# EAGLE schematic PSU (EAGLE 9.6.2)

## Sheet 1 of 2
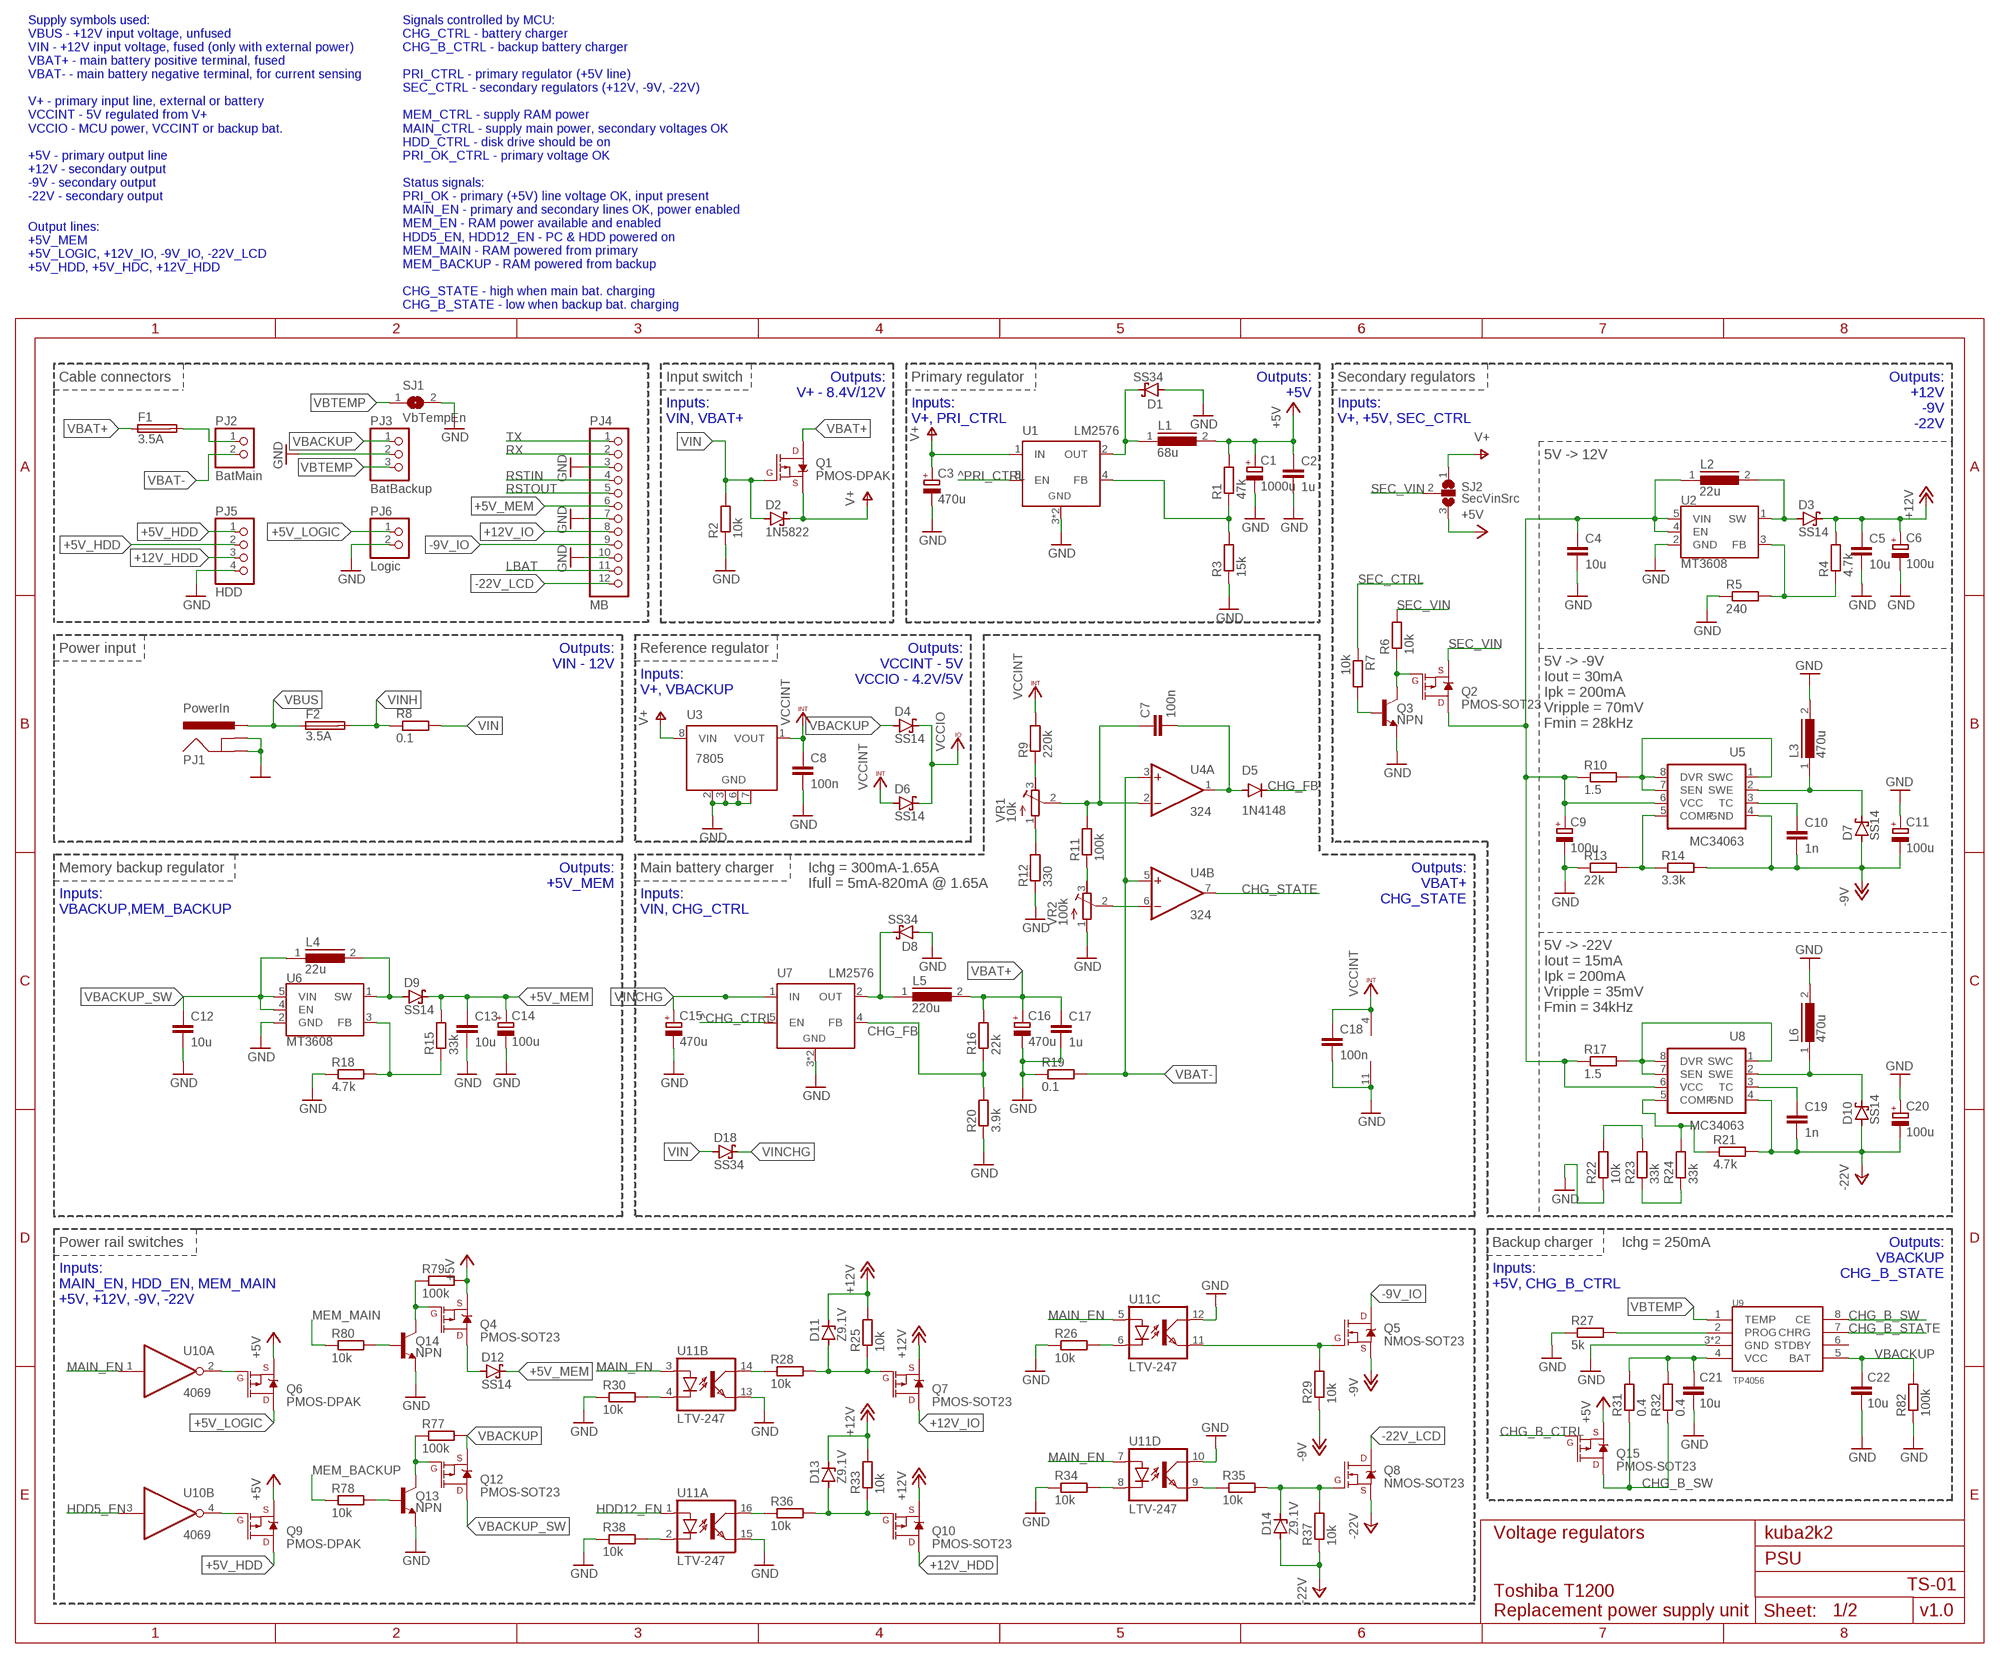
[diagram p0: schematic, sheet 1]

### Parts
C1  1000u  CPOL-EUE5-10.5  [E5-10,5]
C2  1u  C-EU050-024X044  [C050-024X044]
C3  470u  CPOL-EUE3.5-8  [E3,5-8]
C4  10u  C-EUC1206  [C1206]
C5  10u  C-EUC1206  [C1206]
C6  100u  CPOL-EUE3.5-8  [E3,5-8]
C7  100n  C-EUC0805  [C0805]
C8  100n  C-EUC0805  [C0805]
C9  100u  CPOL-EUE3.5-8  [E3,5-8]
C10  1n  C-EUC0805  [C0805]
C11  100u  CPOL-EUE3.5-8  [E3,5-8]
C12  10u  C-EUC1206  [C1206]
C13  10u  C-EUC1206  [C1206]
C14  100u  CPOL-EUE3.5-8  [E3,5-8]
C15  470u  CPOL-EUE3.5-8  [E3,5-8]
C16  470u  CPOL-EUE3.5-8  [E3,5-8]
C17  1u  C-EU050-024X044  [C050-024X044]
C18  100n  C-EUC0805  [C0805]
C19  1n  C-EUC0805  [C0805]
C20  100u  CPOL-EUE3.5-8  [E3,5-8]
C21  10u  C-EUC1206  [C1206]
C22  10u  C-EUC1206  [C1206]
D1  SS34  [SMC]
D2  1N5822  SCHOTTKY-DIODEF126Z12  [F126Z12]
D3  SS14  [DO-214AC]
D4  SS14  [DO-214AC]
D5  1N4148  1N4148DO35-7  [DO35-7]
D6  SS14  [DO-214AC]
D7  SS14  [DO-214AC]
D8  SS34  [SMC]
D9  SS14  [DO-214AC]
D10  SS14  [DO-214AC]
D11  Z9.1V  ZENER-DIODEDO34-7  [DO34Z7]
D12  SS14  [DO-214AC]
D13  Z9.1V  ZENER-DIODEDO34-7  [DO34Z7]
D14  Z9.1V  ZENER-DIODEDO34-7  [DO34Z7]
D18  SS34  [SMC]
F1  3.5A  FUSE-2512  [2512]
F2  3.5A  FUSE-2512  [2512]
L1  68u  SFT1030  [SFT1030]
L2  22u  DR127  [DR127]
L3  470u  COIL0608  [COIL0608]
L4  22u  DR127  [DR127]
L5  220u  SFT1030  [SFT1030]
L6  470u  COIL0608  [COIL0608]
PJ1  PowerIn  POWER_JACK  [POWER_JACK_PTH]
PJ2  BatMain  JST-PH2-4.00  [JST-PH2-4.00]
PJ3  BatBackup  JST-PH3  [JST-PH3]
PJ4  MB  JST-PH12  [JST-PH12]
PJ5  HDD  JST-PH4-2.54  [JST-PH4-2.54]
PJ6  Logic  JST-PH2-2.54  [JST-PH2-2.54]
Q1  PMOS-DPAK  MOSFET_PCH-MCU20P10  [TO-252/DPAK]
Q2  PMOS-SOT23  MOSFET_PCH-IRLML2244  [SOT23-3]
Q3  NPN  TRANS_NPN-MMBT2222AL  [SOT23-3]
Q4  PMOS-SOT23  MOSFET_PCH-IRLML2244  [SOT23-3]
Q5  NMOS-SOT23  MOSFET-NCH-AO3404A  [SOT23-3]
Q6  PMOS-DPAK  MOSFET_PCH-MCU20P10  [TO-252/DPAK]
Q7  PMOS-SOT23  MOSFET_PCH-IRLML2244  [SOT23-3]
Q8  NMOS-SOT23  MOSFET-NCH-AO3404A  [SOT23-3]
Q9  PMOS-DPAK  MOSFET_PCH-MCU20P10  [TO-252/DPAK]
Q10  PMOS-SOT23  MOSFET_PCH-IRLML2244  [SOT23-3]
Q12  PMOS-SOT23  MOSFET_PCH-IRLML2244  [SOT23-3]
Q13  NPN  TRANS_NPN-MMBT2222AL  [SOT23-3]
Q14  NPN  TRANS_NPN-MMBT2222AL  [SOT23-3]
Q15  PMOS-SOT23  MOSFET_PCH-IRLML2244  [SOT23-3]
R1  47k  R-EU_R0805  [R0805]
R2  10k  R-EU_R0805  [R0805]
R3  15k  R-EU_R0805  [R0805]
R4  4.7k  R-EU_R0805  [R0805]
R5  240  R-EU_R0805  [R0805]
R6  10k  R-EU_R0805  [R0805]
R7  10k  R-EU_R0805  [R0805]
R8  0.1  R-EU_0411/15  [0411/15]
R9  220k  R-EU_R0805  [R0805]
R10  1.5  R-EU_0207/10  [0207/10]
R11  100k  R-EU_R0805  [R0805]
R12  330  R-EU_R0805  [R0805]
R13  22k  R-EU_R0805  [R0805]
R14  3.3k  R-EU_R0805  [R0805]
R15  33k  R-EU_R0805  [R0805]
R16  22k  R-EU_R0805  [R0805]
R17  1.5  R-EU_0207/10  [0207/10]
R18  4.7k  R-EU_R0805  [R0805]
R19  0.1  R-EU_0411/15  [0411/15]
R20  3.9k  R-EU_R0805  [R0805]
R21  4.7k  R-EU_R0805  [R0805]
R22  10k  R-EU_R0805  [R0805]
R23  33k  R-EU_R0805  [R0805]
R24  33k  R-EU_R0805  [R0805]
R25  10k  R-EU_R0805  [R0805]
R26  10k  R-EU_R0805  [R0805]
R27  5k  R-EU_R0805  [R0805]
R28  10k  R-EU_R0805  [R0805]
R29  10k  R-EU_R0805  [R0805]
R30  10k  R-EU_R0805  [R0805]
R31  0.4  R-EU_0207/10  [0207/10]
R32  0.4  R-EU_R1206  [R1206]
R33  10k  R-EU_R0805  [R0805]
R34  10k  R-EU_R0805  [R0805]
R35  10k  R-EU_R0805  [R0805]
R36  10k  R-EU_R0805  [R0805]
R37  10k  R-EU_R0805  [R0805]
R38  10k  R-EU_R0805  [R0805]
R77  100k  R-EU_R0805  [R0805]
R78  10k  R-EU_R0805  [R0805]
R79  100k  R-EU_R0805  [R0805]
R80  10k  R-EU_R0805  [R0805]
R82  100k  R-EU_R0805  [R0805]
SJ1  VbTempEn  SJ  [SJ]
SJ2  SecVinSrc  SJ2W  [SJ_2]
U1  LM2576  LM2596TH-VIAHOLE  [TO220-52-VIAHOLE]
U2  MT3608  [SOT23-6]
U3  7805  78L05SMD  [SO08]
U4  324  LM324D  [SO14]
U5  MC34063  MC34063SMD  [SO08]
U6  MT3608  [SOT23-6]
U7  LM2576  LM2596TH-VIAHOLE  [TO220-52-VIAHOLE]
U8  MC34063  MC34063SMD  [SO08]
U9  TP4056  [SO08-PAD]
U10  4069  4069D  [SO14]
U11  LTV-247  [SO16-GULLWING]
VR1  10k  R-TRIMM3296W  [RTRIM3296W]
VR2  100k  R-TRIMM3296W  [RTRIM3296W]

### Nets
+5V [min 1.2A]: C1.+ C2.1 L1.2 Q4.2(S) Q6.3(S) Q9.3(S) Q15.2(S) R1.2 R79.2 SJ2.3 ; also sheet 2
+5V_HDD [2A]: PJ5.1 PJ5.2 Q9.2(D)
+5V_LOGIC [2A]: PJ6.1 Q6.2(D)
+5V_MEM [1.2A]: C13.1 C14.+ D9.C D12.C PJ4.6 R15.2 ; also sheet 2
+5VHDD_G [0.1A]: Q9.1(G) U10.4(B:O)
+5VLOG_G [0.1A]: Q6.1(G) U10.2(A:O)
+5VMEM_B [0.1A]: Q14.1(B) R80.2
+5VMEM_D [1.2A]: D12.A Q4.3(D)
+5VMEM_G [0.1A]: Q4.1(G) Q14.3(C) R79.1
+12V [1.2A]: C5.1 C6.+ D3.C D11.C D13.C Q7.2(S) Q10.2(S) R4.2 R25.2 R33.2 ; also sheet 2
+12V_FB [0.1A]: R4.1 R5.2 U2.3(FB)
+12V_HDD [1.2A]: PJ5.3 Q10.3(D)
+12V_IO [1.2A]: PJ4.8 Q7.3(D)
+12V_SW [1.2A]: D3.A L2.2 U2.1(SW)
+12VHDD_C [0.1A]: R36.1 U11.16(A:COL)
+12VHDD_G [0.1A]: D13.A Q10.1(G) R33.1 R36.2
+12VHDD_N [0.1A]: R38.2 U11.2(A:C)
+12VIO_C [0.1A]: R28.1 U11.14(B:COL)
+12VIO_G [0.1A]: D11.A Q7.1(G) R25.1 R28.2
+12VIO_N [0.1A]: R30.2 U11.4(B:C)
-9V [1.2A]: C10.2 C11.- D7.A Q5.2(S) R14.2 R29.1 U5.4(GND) ; also sheet 2
-9V_COMP [0.1A]: R13.2 R14.1 U5.5(COMP)
-9V_IO [1.2A]: PJ4.9 Q5.3(D)
-9V_SWC [1.2A]: R10.2 U5.1(SWC) U5.7(SEN) U5.8(DVR)
-9V_SWE [1.2A]: D7.C L3.1 U5.2(SWE)
-9V_TC [0.1A]: C10.1 U5.3(TC)
-9VIO_G [0.1A]: Q5.1(G) R29.2 U11.11(C:EMIT)
-9VIO_N [0.1A]: R26.2 U11.6(C:C)
-22V [1.2A]: C19.2 C20.- D10.A D14.A Q8.2(S) R21.2 R37.1 U8.4(GND) ; also sheet 2
-22V_COMP1 [0.1A]: R21.1 R24.2 U8.5(COMP)
-22V_COMP2 [0.1A]: R23.1 R24.1
-22V_COMP3 [0.1A]: R22.2 R23.2
-22V_LCD [1.2A]: PJ4.12 Q8.3(D)
-22V_SWC [1.2A]: R17.2 U8.1(SWC) U8.7(SEN) U8.8(DVR)
-22V_SWE [1.2A]: D10.C L6.1 U8.2(SWE)
-22V_TC [0.1A]: C19.1 U8.3(TC)
-22VLCD_E [0.1A]: R35.1 U11.9(D:EMIT)
-22VLCD_G [0.1A]: D14.C Q8.1(G) R35.2 R37.2
-22VLCD_N [0.1A]: R34.2 U11.8(D:C)
^CHG_CTRL [0.1A]: U7.5(EN) ; also sheet 2
^PRI_CTRL [0.1A]: U1.5(EN) ; also sheet 2
CC_VAL [0.1A]: C7.1 R11.2 U4.2(A:-IN) VR1.2(S)
CHG_B_CTRL [0.1A]: Q15.1(G) ; also sheet 2
CHG_B_PROG [0.1A]: R27.2 U9.2(PROG)
CHG_B_STATE [0.1A]: U9.7(CHRG) ; also sheet 2
CHG_B_SW [min 1.2A]: Q15.3(D) R31.1 R32.1 U9.8(CE)
CHG_B_VCC [1.2A]: C21.1 R31.2 R32.2 U9.4(VCC)
CHG_DIV1 [0.1A]: R11.1 VR2.3(E)
CHG_DIV2 [0.1A]: R12.2 VR1.1(A)
CHG_DIV3 [0.1A]: R9.1 VR1.3(E)
CHG_FB [0.1A]: D5.C R16.1 R20.2 U7.4(FB)
CHG_FB_OUT [0.1A]: C7.2 D5.A U4.1(A:OUT)
CHG_OUT [1.2A]: D8.C L5.1 U7.2(OUT)
CHG_STATE [0.1A]: U4.7(B:OUT) ; also sheet 2
FULL_VAL [0.1A]: U4.6(B:-IN) VR2.2(S)
GND: C1.- C2.2 C3.- C4.2 C5.2 C6.- C8.2 C9.- C11.+ C12.2 C13.2 C14.- C15.- C16.- C17.2 C18.2 C20.+ C21.2 C22.2 D1.A D8.A L3.2 L6.2 PJ1.GND PJ1.GNDBREAK PJ3.2 PJ4.3 PJ4.7 PJ4.10 PJ5.4 PJ6.2 Q3.2(E) Q13.2(E) Q14.2(E) R2.1 R3.1 R5.1 R12.1 R13.1 R18.1 R19.1 R20.1 R22.1 R26.1 R27.1 R30.1 R34.1 R38.1 R82.1 SJ1.2 U1.3(GND) U1.TAB(GND) U2.2(GND) U3.2(GND) U3.3(GND) U3.6(GND) U3.7(GND) U4.11(P:V-) U6.2(GND) U7.3(GND) U7.TAB(GND) U9.3(GND) U9.PAD(GND) U11.10(D:COL) U11.12(C:COL) U11.13(B:EMIT) U11.15(A:EMIT) VR2.1(A) ; also sheet 2
HDD5_EN [0.1A]: U10.3(B:I) ; also sheet 2
HDD12_EN [0.1A]: U11.1(A:A) ; also sheet 2
LBAT [0.1A]: PJ4.11 ; also sheet 2
MAIN_EN [0.1A]: U10.1(A:I) U11.3(B:A) U11.5(C:A) U11.7(D:A) ; also sheet 2
MB_FB [0.1A]: R15.1 R18.2 U6.3(FB)
MB_SW [1.2A]: D9.A L4.2 U6.1(SW)
MEM_BACKUP [0.1A]: R78.1 ; also sheet 2
MEM_MAIN [0.1A]: R80.1 ; also sheet 2
PRI_FB [0.1A]: R1.1 R3.2 U1.4(FB)
PRI_OUT: D1.C L1.1 U1.2(OUT)
RSTIN [0.1A]: PJ4.4 ; also sheet 2
RSTOUT [0.1A]: PJ4.5 ; also sheet 2
RX [0.1A]: PJ4.2 ; also sheet 2
SEC_CTRL [0.1A]: R7.1 ; also sheet 2
SEC_VIN [1.2A]: Q2.2(S) R6.2 SJ2.2
SEC_VIN_SW [1.2A]: C4.1 C9.+ L2.1 Q2.3(D) R10.1 R17.1 U2.4(EN) U2.5(VIN) U5.6(VCC) U8.6(VCC)
SECV_B [0.1A]: Q3.1(B) R7.2
SECV_G [0.1A]: Q2.1(G) Q3.3(C) R6.1
TX [0.1A]: PJ4.1 ; also sheet 2
V+: C3.+ D2.C Q1.3(S) SJ2.1 U1.1(IN) U3.8(VIN) ; also sheet 2
VBACKUP [1.2A]: C22.1 D4.A PJ3.1 Q12.2(S) R77.2 R82.2 U9.5(BAT) ; also sheet 2
VBACKUP_SW [1.2A]: C12.1 L4.1 Q12.3(D) U6.4(EN) U6.5(VIN)
VBACKUP_SW_B [0.1A]: Q13.1(B) R78.2
VBACKUP_SW_G [0.1A]: Q12.1(G) Q13.3(C) R77.1
VBAT+ [min 1.2A]: C16.+ C17.1 F1.1 L5.2 Q1.2(D) R16.2 ; also sheet 2
VBAT- [min 1.2A]: PJ2.2 R19.2 U4.3(A:+IN) U4.5(B:+IN) ; also sheet 2
VBAT_RAW [3A]: F1.2 PJ2.1
VBTEMP [0.1A]: PJ3.3 SJ1.1 U9.1(TEMP)
VBUS [3.5A]: F2.1 PJ1.PWR
VCCINT [0.1A]: C8.1 C18.1 D6.A R9.2 U3.1(VOUT) U4.4(P:V+) ; also sheet 2
VCCIO [0.1A]: D4.C D6.C ; also sheet 2
VIN: D2.A D18.A Q1.1(G) R2.2 R8.2 ; also sheet 2
VINCHG: C15.+ D18.C U7.1(IN)
VINH: F2.2 R8.1 ; also sheet 2
Unconnected: U3.4(NC) U3.5(NC) U9.6(STDBY)

### Notes on the sheet
- Supply symbols used:
  VBUS - +12V input voltage, unfused
  VIN - +12V input voltage, fused (only with external power)
  VBAT+ - main battery positive terminal, fused
  VBAT- - main battery negative terminal, for current sensing
  
  V+ - primary input line, external or battery
  VCCINT - 5V regulated from V+
  VCCIO - MCU power, VCCINT or backup bat.
  
  +5V - primary output line
  +12V - secondary output
  -9V - secondary output
  -22V - secondary output
- Signals controlled by MCU:
  CHG_CTRL - battery charger
  CHG_B_CTRL - backup battery charger
  
  PRI_CTRL - primary regulator (+5V line)
  SEC_CTRL - secondary regulators (+12V, -9V, -22V)
  
  MEM_CTRL - supply RAM power
  MAIN_CTRL - supply main power, secondary voltages OK
  HDD_CTRL - disk drive should be on
  PRI_OK_CTRL - primary voltage OK
  
  Status signals:
  PRI_OK - primary (+5V) line voltage OK, input present
  MAIN_EN - primary and secondary lines OK, power enabled
  MEM_EN - RAM power available and enabled
  HDD5_EN, HDD12_EN - PC & HDD powered on
  MEM_MAIN - RAM powered from primary
  MEM_BACKUP - RAM powered from backup
  
  CHG_STATE - high when main bat. charging
  CHG_B_STATE - low when backup bat. charging
- Output lines:
  +5V_MEM
  +5V_LOGIC, +12V_IO, -9V_IO, -22V_LCD
  +5V_HDD, +5V_HDC, +12V_HDD
- Cable connectors | Input switch
- Outputs:
  V+ - 8.4V/12V
- Primary regulator
- Outputs:
  +5V
- Secondary regulators
- Outputs:
  +12V
  -9V
  -22V
- Inputs:
  VIN, VBAT+
- Inputs:
  V+, PRI_CTRL
- Inputs:
  V+, +5V, SEC_CTRL
- 5V -> 12V
- Power input
- Outputs:
  VIN - 12V
- Reference regulator
- Outputs:
  VCCINT - 5V
  VCCIO - 4.2V/5V
- 5V -> -9V
  Iout = 30mA
  Ipk = 200mA
  Vripple = 70mV
  Fmin = 28kHz
- Inputs:
  V+, VBACKUP
- Memory backup regulator
- Outputs:
  +5V_MEM
- Main battery charger
- Ichg = 300mA-1.65A
  Ifull = 5mA-820mA @ 1.65A
- Outputs:
  VBAT+
  CHG_STATE
- Inputs:
  VBACKUP,MEM_BACKUP
- Inputs:
  VIN, CHG_CTRL
- 5V -> -22V
  Iout = 15mA
  Ipk = 200mA
  Vripple = 35mV
  Fmin = 34kHz
- Power rail switches | Backup charger | Ichg = 250mA
- Outputs:
  VBACKUP
  CHG_B_STATE
- Inputs:
  MAIN_EN, HDD_EN, MEM_MAIN
  +5V, +12V, -9V, -22V
- Inputs:
  +5V, CHG_B_CTRL
- Voltage regulators | kuba2k2
- TS-01
- Toshiba T1200
  Replacement power supply unit
- v1.0

## Sheet 2 of 2
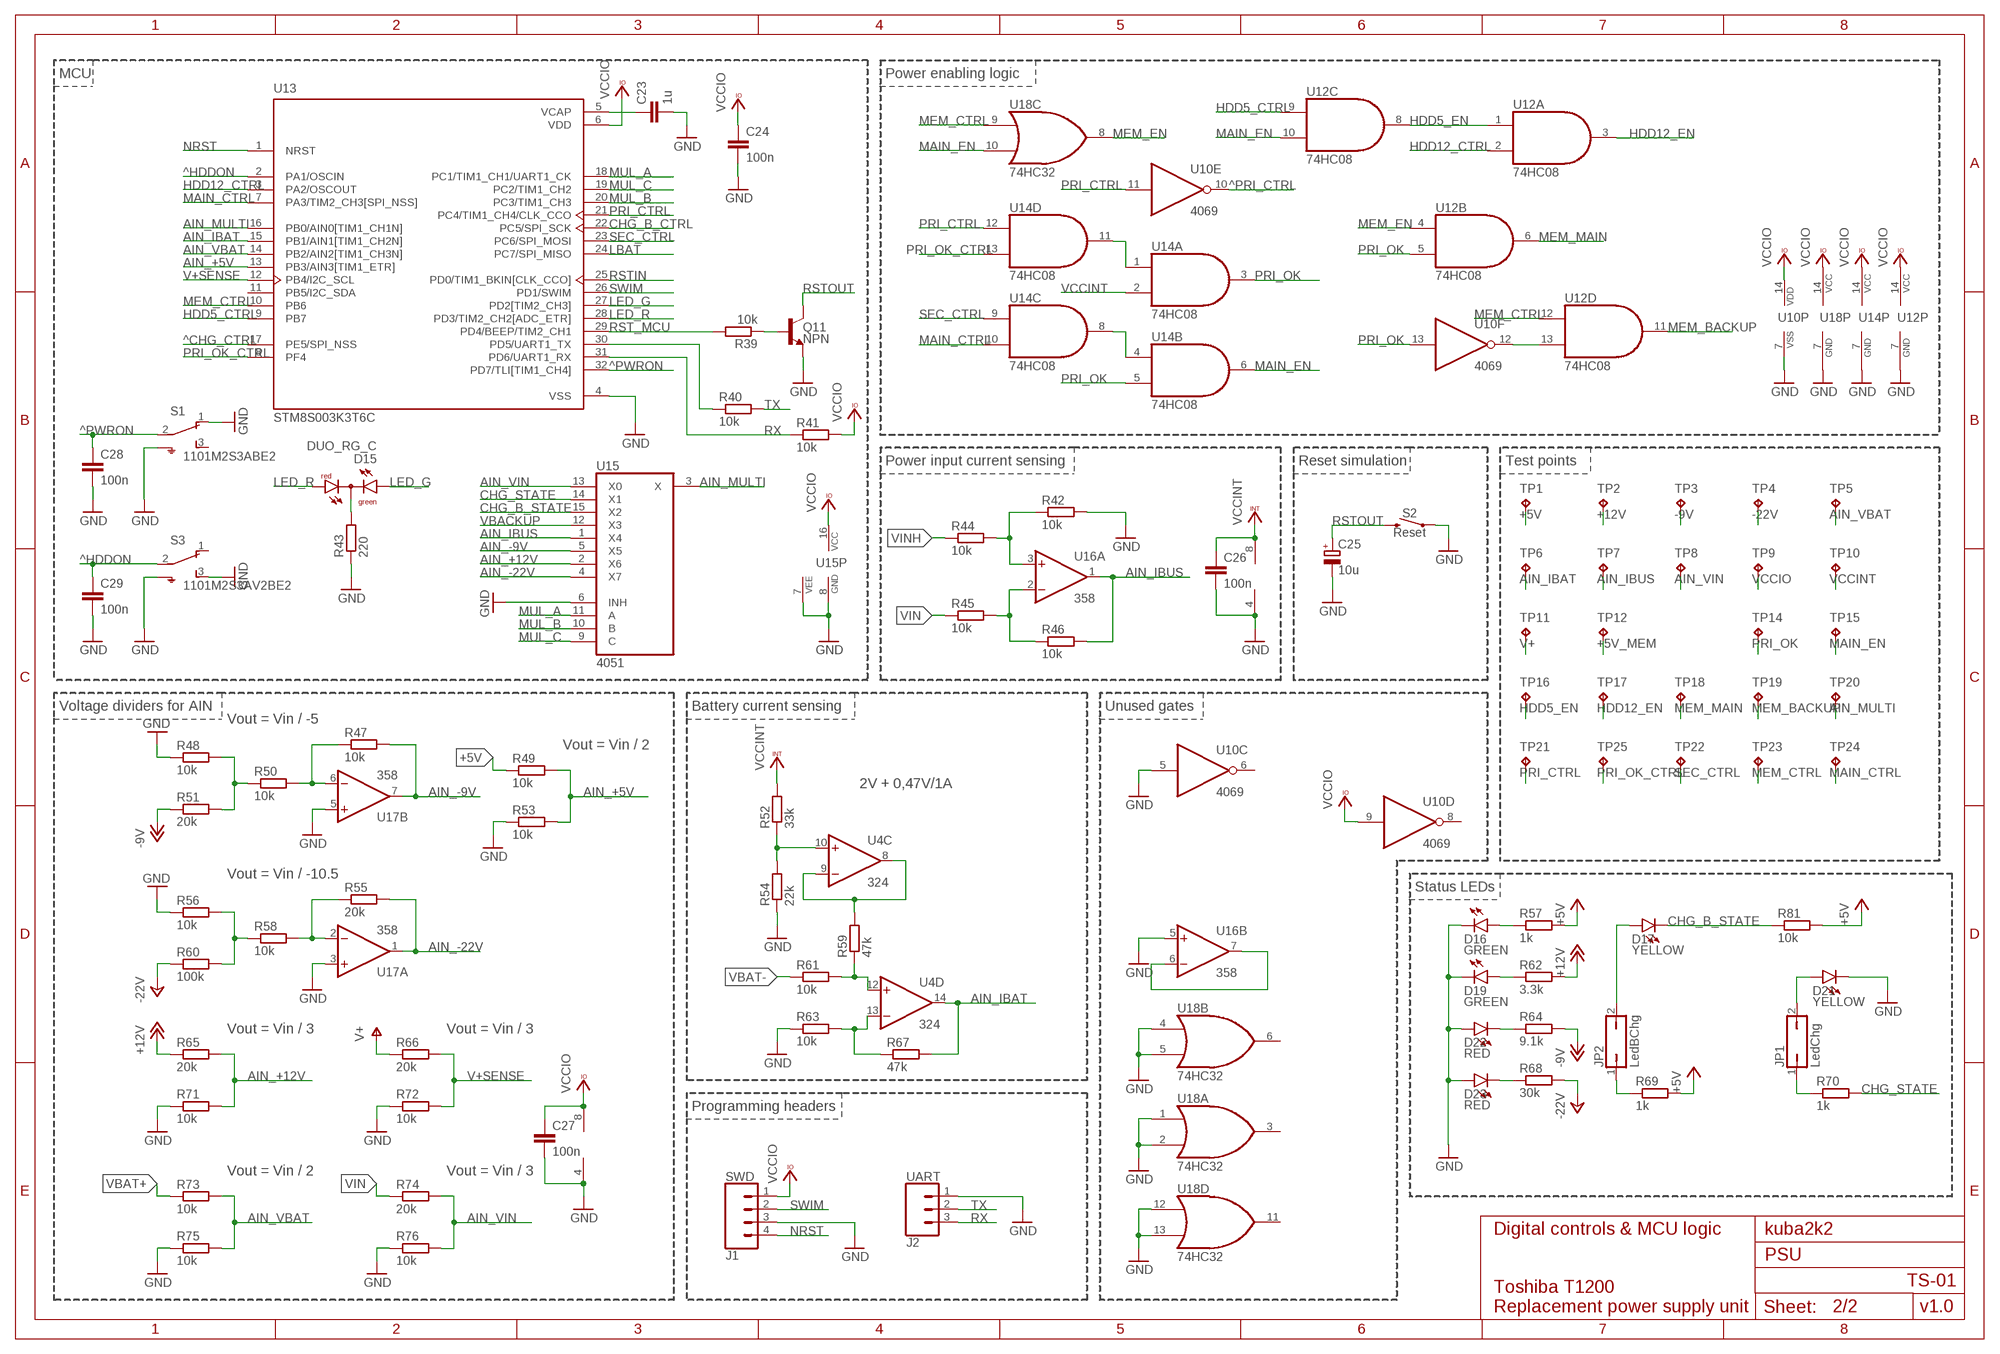
[diagram p1: schematic, sheet 2]

### Parts
C23  1u  C-EU050-024X044  [C050-024X044]
C24  100n  C-EUC0805  [C0805]
C25  10u  CPOL-EUE2-5  [E2-5]
C26  100n  C-EUC0805  [C0805]
C27  100n  C-EUC0805  [C0805]
C28  100n  C-EUC0805  [C0805]
C29  100n  C-EUC0805  [C0805]
D15  DUO_RG_C  DUOLED-RG-C  [DUOLED-C-5MM]
D16  GREEN  LEDCHIP-LED0805  [CHIP-LED0805]
D17  YELLOW  LEDCHIP-LED0805  [CHIP-LED0805]
D19  GREEN  LEDCHIP-LED0805  [CHIP-LED0805]
D21  YELLOW  LEDCHIP-LED0805  [CHIP-LED0805]
D22  RED  LEDCHIP-LED0805  [CHIP-LED0805]
D23  RED  LEDCHIP-LED0805  [CHIP-LED0805]
J1  SWD  CONN_04PTH  [1X04]
J2  UART  CONN_03  [1X03]
JP1  LedChg  JP1Q  [JP1]
JP2  LedBChg  JP1Q  [JP1]
Q11  NPN  TRANS_NPN-MMBT2222AL  [SOT23-3]
R39  10k  R-EU_R0805  [R0805]
R40  10k  R-EU_R0805  [R0805]
R41  10k  R-EU_R0805  [R0805]
R42  10k  R-EU_R0805  [R0805]
R43  220  R-EU_R0805  [R0805]
R44  10k  R-EU_R0805  [R0805]
R45  10k  R-EU_R0805  [R0805]
R46  10k  R-EU_R0805  [R0805]
R47  10k  R-EU_R0805  [R0805]
R48  10k  R-EU_R0805  [R0805]
R49  10k  R-EU_R0805  [R0805]
R50  10k  R-EU_R0805  [R0805]
R51  20k  R-EU_R0805  [R0805]
R52  33k  R-EU_R0805  [R0805]
R53  10k  R-EU_R0805  [R0805]
R54  22k  R-EU_R0805  [R0805]
R55  20k  R-EU_R0805  [R0805]
R56  10k  R-EU_R0805  [R0805]
R57  1k  R-EU_R0805  [R0805]
R58  10k  R-EU_R0805  [R0805]
R59  47k  R-EU_R0805  [R0805]
R60  100k  R-EU_R0805  [R0805]
R61  10k  R-EU_R0805  [R0805]
R62  3.3k  R-EU_R0805  [R0805]
R63  10k  R-EU_R0805  [R0805]
R64  9.1k  R-EU_R0805  [R0805]
R65  20k  R-EU_R0805  [R0805]
R66  20k  R-EU_R0805  [R0805]
R67  47k  R-EU_R0805  [R0805]
R68  30k  R-EU_R0805  [R0805]
R69  1k  R-EU_R0805  [R0805]
R70  1k  R-EU_R0805  [R0805]
R71  10k  R-EU_R0805  [R0805]
R72  10k  R-EU_R0805  [R0805]
R73  10k  R-EU_R0805  [R0805]
R74  20k  R-EU_R0805  [R0805]
R75  10k  R-EU_R0805  [R0805]
R76  10k  R-EU_R0805  [R0805]
R81  10k  R-EU_R0805  [R0805]
S1  1101M2S3ABE2  [1101M2S3ABE2]
S2  Reset  MOMENTARY-SWITCH-SPST-SMD-6.2MM-TALL  [TACTILE_SWITCH_SMD_6.2MM_TALL]
S3  1101M2S3AV2BE2  [1101M2S3AV2BE2]
TP1  TPB1,27  [B1,27]
TP2  TPB1,27  [B1,27]
TP3  TPB1,27  [B1,27]
TP4  TPB1,27  [B1,27]
TP5  TPB1,27  [B1,27]
TP6  TPB1,27  [B1,27]
TP7  TPB1,27  [B1,27]
TP8  TPB1,27  [B1,27]
TP9  TPB1,27  [B1,27]
TP10  TPB1,27  [B1,27]
TP11  TPB1,27  [B1,27]
TP12  TPB1,27  [B1,27]
TP14  TPB1,27  [B1,27]
TP15  TPB1,27  [B1,27]
TP16  TPB1,27  [B1,27]
TP17  TPB1,27  [B1,27]
TP18  TPB1,27  [B1,27]
TP19  TPB1,27  [B1,27]
TP20  TPB1,27  [B1,27]
TP21  TPB1,27  [B1,27]
TP22  TPB1,27  [B1,27]
TP23  TPB1,27  [B1,27]
TP24  TPB1,27  [B1,27]
TP25  TPB1,27  [B1,27]
U12  74HC08  74LS08D  [SO14]
U13  STM8S003K3T6C  [QFP80P900X900X160-32N]
U14  74HC08  74LS08D  [SO14]
U15  4051  4051D  [SO16]
U16  358  LM358D  [SO08]
U17  358  LM358D  [SO08]
U18  74HC32  7432D  [SO14]

### Nets
+5V [min 1.2A]: R49.1 R57.2 R69.2 R81.2 TP1.TP ; also sheet 1
+5V_MEM [1.2A]: TP12.TP ; also sheet 1
+12V [1.2A]: R62.2 R65.1 TP2.TP ; also sheet 1
-9V [1.2A]: R51.1 R64.2 TP3.TP ; also sheet 1
-22V [1.2A]: R60.1 R68.2 TP4.TP ; also sheet 1
^CHG_CTRL [0.1A]: U13.17(PE5/SPI_NSS) ; also sheet 1
^HDDON [0.1A]: C29.1 S3.2(P) U13.2(PA1/OSCIN)
^PRI_CTRL [0.1A]: U10.10(E:O) ; also sheet 1
^PWRON [0.1A]: C28.1 S1.2(P) U13.32(PD7/TLI[TIM1_CH4])
AIN9DIV [0.1A]: R48.2 R50.1 R51.2
AIN9N [0.1A]: R47.1 R50.2 U17.6(B:-IN)
AIN22DIV [0.1A]: R56.2 R58.1 R60.2
AIN22N [0.1A]: R55.1 R58.2 U17.2(A:-IN)
AIN_+5V [0.1A]: R49.2 R53.2 U13.13(PB3/AIN3[TIM1_ETR])
AIN_+12V [0.1A]: R65.2 R71.2 U15.2(X6)
AIN_-9V [0.1A]: R47.2 U15.5(X5) U17.7(B:OUT)
AIN_-22V [0.1A]: R55.2 U15.4(X7) U17.1(A:OUT)
AIN_IBAT [0.1A]: R67.2 TP6.TP U4.14(D:OUT) U13.15(PB1/AIN1[TIM1_CH2N])
AIN_IBUS [0.1A]: R46.2 TP7.TP U15.1(X4) U16.1(A:OUT)
AIN_MULTI [0.1A]: TP20.TP U13.16(PB0/AIN0[TIM1_CH1N]) U15.3(X)
AIN_VBAT [0.1A]: R73.2 R75.2 TP5.TP U13.14(PB2/AIN2[TIM1_CH3N])
AIN_VIN [0.1A]: R74.2 R76.2 TP8.TP U15.13(X0)
CHG_B_CTRL [0.1A]: U13.22(PC5/SPI_SCK) ; also sheet 1
CHG_B_STATE [0.1A]: D17.C R81.1 U15.15(X2) ; also sheet 1
CHG_STATE [0.1A]: R70.2 U15.14(X1) ; also sheet 1
GND: C23.2 C24.2 C25.- C26.2 C27.2 C28.2 C29.2 D16.C D19.C D21.C D22.A D23.A J1.3 J2.1 Q11.2(E) R42.2 R43.1 R48.1 R53.1 R54.1 R56.1 R63.1 R71.1 R72.1 R75.1 R76.1 S1.1(O) S1.S1(SH) S1.S2(SH) S2.A2 S3.3(S) S3.S1(SH) S3.S2(SH) U10.5(C:I) U10.7(P:VSS) U12.7(P:GND) U13.4(VSS) U14.7(P:GND) U15.6(INH) U15.7(VEE) U15.8(GND) U16.4(P:V-) U16.5(B:+IN) U17.3(A:+IN) U17.4(P:V-) U17.5(B:+IN) U18.1(A:I0) U18.2(A:I1) U18.4(B:I0) U18.5(B:I1) U18.7(P:GND) U18.12(D:I0) U18.13(D:I1) ; also sheet 1
HDD5_CTRL [0.1A]: U12.9(C:I0) U13.9(PB7)
HDD5_EN [0.1A]: TP16.TP U12.1(A:I0) U12.8(C:O) ; also sheet 1
HDD12_CTRL [0.1A]: U12.2(A:I1) U13.3(PA2/OSCOUT)
HDD12_EN [0.1A]: TP17.TP U12.3(A:O) ; also sheet 1
IBAT_DIVN [0.1A]: R59.2 U4.8(C:OUT) U4.9(C:-IN)
IBAT_DIVP [0.1A]: R52.1 R54.2 U4.10(C:+IN)
IBAT_N [0.1A]: R63.2 R67.1 U4.13(D:-IN)
IBAT_P [0.1A]: R59.1 R61.2 U4.12(D:+IN)
IBUS_N [0.1A]: R45.2 R46.1 U16.2(A:-IN)
IBUS_P [0.1A]: R42.1 R44.2 U16.3(A:+IN)
LBAT [0.1A]: U13.24(PC7/SPI_MISO) ; also sheet 1
LED1_+5 [0.1A]: D16.A R57.1
LED1_+12 [0.1A]: D19.A R62.1
LED1_-9 [0.1A]: D22.C R64.1
LED1_-22 [0.1A]: D23.C R68.1
LED2_EN [0.1A]: D17.A JP2.2
LED2_P [0.1A]: JP2.1 R69.1
LED3_EN [0.1A]: D21.A JP1.2
LED3_P [0.1A]: JP1.1 R70.1
LED_CC [0.1A]: D15.C R43.2
LED_G [0.1A]: D15.AX(AG) U13.27(PD2[TIM2_CH3])
LED_R [0.1A]: D15.AR U13.28(PD3/TIM2_CH2[ADC_ETR])
MAIN_CTRL [0.1A]: TP24.TP U13.7(PA3/TIM2_CH3[SPI_NSS]) U14.10(C:I1)
MAIN_EN [0.1A]: TP15.TP U12.10(C:I1) U14.6(B:O) U18.10(C:I1) ; also sheet 1
MAIN_MID [0.1A]: U14.4(B:I0) U14.8(C:O)
MB_MID [0.1A]: U10.12(F:O) U12.13(D:I1)
MEM_BACKUP [0.1A]: TP19.TP U12.11(D:O) ; also sheet 1
MEM_CTRL [0.1A]: TP23.TP U12.12(D:I0) U13.10(PB6) U18.9(C:I0)
MEM_EN [0.1A]: U12.4(B:I0) U18.8(C:O)
MEM_MAIN [0.1A]: TP18.TP U12.6(B:O) ; also sheet 1
MUL_A [0.1A]: U13.18(PC1/TIM1_CH1/UART1_CK) U15.11(A)
MUL_B [0.1A]: U13.20(PC3/TIM1_CH3) U15.10(B)
MUL_C [0.1A]: U13.19(PC2/TIM1_CH2) U15.9(C)
NRST [0.1A]: J1.4 U13.1(NRST)
PRI_CTRL [0.1A]: TP21.TP U10.11(E:I) U13.21(PC4/TIM1_CH4/CLK_CCO) U14.12(D:I0)
PRI_MID [0.1A]: U14.1(A:I0) U14.11(D:O)
PRI_OK [0.1A]: TP14.TP U10.13(F:I) U12.5(B:I1) U14.3(A:O) U14.5(B:I1)
PRI_OK_CTRL [0.1A]: TP25.TP U13.8(PF4) U14.13(D:I1)
RST_B [0.1A]: Q11.1(B) R39.1
RST_MCU [0.1A]: R39.2 U13.29(PD4/BEEP/TIM2_CH1)
RSTIN [0.1A]: U13.25(PD0/TIM1_BKIN[CLK_CCO]) ; also sheet 1
RSTOUT [0.1A]: C25.+ Q11.3(C) S2.B2 ; also sheet 1
RX [0.1A]: J2.3 R41.1 U13.31(PD6/UART1_RX) ; also sheet 1
SEC_CTRL [0.1A]: TP22.TP U13.23(PC6/SPI_MOSI) U14.9(C:I0) ; also sheet 1
SWIM [0.1A]: J1.2 U13.26(PD1/SWIM)
TX [0.1A]: J2.2 R40.2 ; also sheet 1
TX_MCU [0.1A]: R40.1 U13.30(PD5/UART1_TX)
U18B [0.1A]: U16.6(B:-IN) U16.7(B:OUT)
V+: R66.1 TP11.TP ; also sheet 1
V+SENSE [0.1A]: R66.2 R72.2 U13.12(PB4/I2C_SCL)
VBACKUP [1.2A]: U15.12(X3) ; also sheet 1
VBAT+ [min 1.2A]: R73.1 ; also sheet 1
VBAT- [min 1.2A]: R61.1 ; also sheet 1
VCAP [0.1A]: C23.1 U13.5(VCAP)
VCCINT [0.1A]: C26.1 R52.2 TP10.TP U14.2(A:I1) U16.8(P:V+) ; also sheet 1
VCCIO [0.1A]: C24.1 C27.1 J1.1 R41.2 TP9.TP U10.9(D:I) U10.14(P:VDD) U12.14(P:VCC) U13.6(VDD) U14.14(P:VCC) U15.16(VCC) U17.8(P:V+) U18.14(P:VCC) ; also sheet 1
VIN: R45.1 R74.1 ; also sheet 1
VINH: R44.1 ; also sheet 1
Unconnected: S1.3(S) S3.1(O) U10.6(C:O) U10.8(D:O) U13.11(PB5/I2C_SDA) U18.3(A:O) U18.6(B:O) U18.11(D:O)

### Notes on the sheet
- MCU | Power enabling logic
- Power input current sensing | Reset simulation | Test points
- Voltage dividers for AIN | Battery current sensing | Unused gates
- Vout = Vin / -5
- Vout = Vin / 2
- 2V + 0,47V/1A
- Vout = Vin / -10.5
- Status LEDs
- Vout = Vin / 3 | Vout = Vin / 3
- Programming headers
- Vout = Vin / 2 | Vout = Vin / 3
- Digital controls & MCU logic | kuba2k2
- TS-01
- Toshiba T1200
  Replacement power supply unit
- v1.0

## Library data of the parts
C1 C3 C6 C9 C11 C14-C16 C20 C25 = rcl:CPOL-EU: POLARIZED CAPACITOR, European symbol; SPICEPREFIX: C
C2 C4 C5 C7 C8 C10 C12 C13 C17-C19 C21-C24 C26-C29 = rcl:C-EU: CAPACITOR, European symbol; SPICEPREFIX: C
D1 D3 D4 D6-D10 D12 D18 = custom:SS*
D2 = diode:SCHOTTKY-DIODE: Schottky Diode
D5 = diode:1N4148: DIODE high speed (Philips)
D11 D13 D14 = diode:ZENER-DIODE: Z-Diode
D15 = led:DUOLED-RG-C: DUO LED 2 colors (red/green), 5 mm, round, common Cathode www.ligitek.com or other producers.
D16 D17 D19 D21-D23 = led:LED: LED OSRAM: - CHIPLED LG R971, LG N971, LY N971, LG Q971, LY Q971, LO R971, LY R971 LH N974, LH R974 LS Q976, LO Q976, LY Q976 LO Q996 - Hyper CHIPLED LW Q18S LB Q993, LB Q99A, LB R99A - SideLED LS A670, LO A670, LY A670, LG A670, LP A670 LB A673, LV A673, LT A673, LW A673 LH A674 LY A675 LS A676, LA A676, LO A676, LY A676, LW A676 LS A679, LY A679, LG A679 - Hyper Micro SIDELED® LS Y876, LA Y876, LO Y876, LY Y876 LT Y87S - SmartLED LW L88C, LW L88S LB L89C, LB L89S, LG L890 LS L89K, LO L89K, LY L89K LS L896, LA L896, LO L896, LY L896 - TOPLED LS T670, LO T670, LY T670, LG T670, LP T670 LSG T670, LSP T670, LSY T670, LOP T670, LYG T670 LG T671, LOG T671, LSG T671 LB T673, LV T673, LT T673, LW T673 LH T674 LS T676, LA T676, LO T676, LY T676, LB T676, LH T676, LSB T676, LW T676 LB T67C, LV T67C, LT T67C, LS T67K, LO T67K, LY T67K, LW E67C LS E67B, LA E67B, LO E67B, LY E67B, LB E67C, LV E67C, LT E67C LW T67C LS T679, LY T679, LG T679 LS T770, LO T770, LY T770, LG T770, LP T770 LB T773, LV T773, LT T773, LW T773 LH T774 LS E675, LA E675, LY E675, LS T675 LS T776, LA T776, LO T776, LY T776, LB T776 LHGB T686 LT T68C, LB T68C - Hyper Mini TOPLED® LB M676 - Mini TOPLED Santana® LG M470 LS M47K, LO M47K, LY M47K Source: http://www.osram.convergy.de LUXEON: - LUMILED® LXK2-PW12-R00, LXK2-PW12-S00, LXK2-PW14-U00, LXK2-PW14-V00 LXK2-PM12-R00, LXK2-PM12-S00, LXK2-PM14-U00 LXK2-PE12-Q00, LXK2-PE12-R00, LXK2-PE12-S00, LXK2-PE14-T00, LXK2-PE14-U00 LXK2-PB12-K00, LXK2-PB12-L00, LXK2-PB12-M00, LXK2-PB14-N00, LXK2-PB14-P00, LXK2-PB14-Q00 LXK2-PR12-L00, LXK2-PR12-M00, LXK2-PR14-Q00, LXK2-PR14-R00 LXK2-PD12-Q00, LXK2-PD12-R00, LXK2-PD12-S00 LXK2-PH12-R00, LXK2-PH12-S00 LXK2-PL12-P00, LXK2-PL12-Q00, LXK2-PL12-R00 Source: www.luxeon.com KINGBRIGHT: KA-3528ASYC Source: www.kingbright.com
F1 F2 = custom:FUSE-
J1 = SparkFun-Connectors:CONN_04: Multi connection point. Often used as Generic Header-pin footprint for 0.1 inch spaced/style header connections On any of the 0.1 inch spaced packages, you can populate with these: Break Away Headers - Straight <https://www.sparkfun.com/products/116> (PRT-00116) Break Away Male Headers - Right Angle <https://www.sparkfun.com/products/553> (PRT-00553) Female Headers <https://www.sparkfun.com/products/115> (PRT-00115) Break Away Headers - Machine Pin <https://www.sparkfun.com/products/117> (PRT-00117) Break Away Female Headers - Swiss Machine Pin <https://www.sparkfun.com/products/743> (PRT-00743) For SCREWTERMINALS and SPRING TERMINALS visit here: Screw Terimnals on SparkFun.com <https://www.sparkfun.com/search/results?term=Screw+Terminals> (5mm/3.5mm/2.54mm spacing) This device is also useful as a general connection point to wire up your design to another part of your project. Our various solder wires solder well into these plated through hole pads. Hook-Up Wire - Assortment (Stranded, 22 AWG) <https://www.sparkfun.com/products/11375> (PRT-11375) Hook-Up Wire - Assortment (Solid Core, 22 AWG) <https://www.sparkfun.com/products/11367> (PRT-11367) View the entire wire category on our website here <https://www.sparkfun.com/categories/141> Special notes: Molex polarized connector foot print use with SKU : PRT-08231 with associated crimp pins and housings. 1MM SMD Version SKU: PRT-10208; PROD_ID: CONN-09696
J2 = SparkFun-Connectors:CONN_03: Multi connection point. Often used as Generic Header-pin footprint for 0.1 inch spaced/style header connections On any of the 0.1 inch spaced packages, you can populate with these: Break Away Headers - Straight <https://www.sparkfun.com/products/116> (PRT-00116) Break Away Male Headers - Right Angle <https://www.sparkfun.com/products/553> (PRT-00553) Female Headers <https://www.sparkfun.com/products/115> (PRT-00115) Break Away Headers - Machine Pin <https://www.sparkfun.com/products/117> (PRT-00117) Break Away Female Headers - Swiss Machine Pin <https://www.sparkfun.com/products/743> (PRT-00743) Stackable Header - 3 Pin (Female, 0.1") <https://www.sparkfun.com/products/13875> (PRT-13875) For SCREWTERMINALS and SPRING TERMINALS visit here: Screw Terimnals on SparkFun.com <https://www.sparkfun.com/search/results?term=Screw+Terminals> (5mm/3.5mm/2.54mm spacing) This device is also useful as a general connection point to wire up your design to another part of your project. Our various solder wires solder well into these plated through hole pads. Hook-Up Wire - Assortment (Stranded, 22 AWG) <https://www.sparkfun.com/products/11375> (PRT-11375) Hook-Up Wire - Assortment (Solid Core, 22 AWG) <https://www.sparkfun.com/products/11367> (PRT-11367) View the entire wire category on our website here <https://www.sparkfun.com/categories/141> Special notes: Molex polarized connector foot print use with SKU : PRT-08232 with associated crimp pins and housings.; PROD_ID: XXX-00000; VALUE: 455-1750-1-ND
JP1 JP2 = jumper:JP1Q: JUMPER
L1 L5 = inductors:SFT1030: INDUCTOR; SPICEPREFIX: L
L2 L4 = inductors:DR127: High Power Density, High Efficiency, Shielded Inductors Source: coiltronics_dr_series.pdf; SPICEPREFIX: L
L3 L6 = custom:COIL0608: INDUCTOR
PJ1 = SparkFun-Connectors:POWER_JACK: Power Jack Connector This is the standard 5.5mm barrel jack for power. The PTH is the most common, proven, reliable, footprint. The Slot footprint only works if the mill layer is transmitted to the PCB fab house so be warned. Here are the connectors we sell at SparkFun: DC Barrel Power Jack/Connector <https://www.sparkfun.com/products/119> (PRT-00119) DC Barrel Power Jack/Connector (SMD) <https://www.sparkfun.com/products/12748> (PRT-12748) DC Barrel Jack Adapter - Breadboard Compatible <https://www.sparkfun.com/products/10811> (PRT-10811) It is used on this SparkFun product (and many, many others): SparkFun RedBoard - Programmed with Arduino <https://www.sparkfun.com/products/12757> (DEV-12757) Also, if you need a mating power supply or connector, please check these out: Wall Adapter Power Supply - 9VDC 650mA <https://www.sparkfun.com/products/298> (TOL-00298) DC Barrel Jack Adapter - Male <https://www.sparkfun.com/products/10287> (PRT-10287); PROD_ID: CONN-08197
PJ2 PJ6 = jst-ph:JST-PH2
PJ3 = jst-ph:JST-PH3
PJ4 = jst-ph:JST-PH12
PJ5 = jst-ph:JST-PH4
Q1 Q6 Q9 = SparkFun-DiscreteSemi:MOSFET_PCH: P-channel MOSFETs Voltage controlled devices that allow control of high current outputs. SparkFun Products: SparkFun ESP32 Thing <https://www.sparkfun.com/products/13907> SparkFun ESP8266 Thing <https://www.sparkfun.com/products/13231> SparkFun Pi Servo HAT V2 <https://www.sparkfun.com/products/15316> DMG2305UX-7 (20V/4.2A/SOT23-3); PROD_ID: TRAN-15964; VALUE: 20A/100V/110mΩ
Q2 Q4 Q7 Q10 Q12 Q15 = SparkFun-DiscreteSemi:MOSFET_PCH: P-channel MOSFETs Voltage controlled devices that allow control of high current outputs. SparkFun Products: SparkFun ESP32 Thing <https://www.sparkfun.com/products/13907> SparkFun ESP8266 Thing <https://www.sparkfun.com/products/13231> SparkFun Pi Servo HAT V2 <https://www.sparkfun.com/products/15316> DMG2305UX-7 (20V/4.2A/SOT23-3); PROD_ID: TRANS-11153; VALUE: 4.3A/20V/54mΩ
Q3 Q11 Q13 Q14 = SparkFun-DiscreteSemi:TRANS_NPN: NPN transistor Current controlled devices typically used to amplify current or used as a switch. BC547 - COM-08928 <http://www.sparkfun.com/products/8928> (TO-92 45V 100mA) (1.Collector 2.Base 3.Emitter) 2N3904 - COM-00521 <http://www.sparkfun.com/products/521> (TO-92 40V 200mA) (1.Emitter 2.Base 3.Collector) P2N2222A - COM-12852 <http://www.sparkfun.com/products/12852> (TO-92 40V 600mA) (1.Collector 2.Base 3.Emitter); PROD_ID: TRANS-08049; VALUE: 600mA/40V
Q5 Q8 = SparkFun-DiscreteSemi:MOSFET-NCH: N-channel MOSFETs Voltage controlled devices that allow control of high current outputs. SparkFun Products: SparkFun OpenScale <https://www.sparkfun.com/products/13261> SparkFun Digital Sandbox <https://www.sparkfun.com/products/12651> SparkFun Monster Moto Shield <https://www.sparkfun.com/products/10182> SparkFun MOSFET Power Controller <https://www.sparkfun.com/products/11214>; PROD_ID: TRANS-12988; VALUE: 5.8A/30V/35mΩ
R1-R82 = rcl:R-EU_: RESISTOR, European symbol; SPICEPREFIX: R
S1 S3 = T1200:1101
S2 = SparkFun-Switches:MOMENTARY-SWITCH-SPST: Momentary Switch (Pushbutton) - SPST Normally-open (NO) SPST momentary switches (buttons, pushbuttons). Variants PTH-12MM - 12mm square, through-hole Momentary Pushbutton Switch - 12mm Square <https://www.sparkfun.com/products/9190> (COM-09190) PTH-6.0MM, PTH-6.0MM-KIT - 6.0mm square, through-hole Mini Pushbutton Switch <https://www.sparkfun.com/products/97> (COM-00097) KIT package intended for soldering kit's - only one side of pads' copper is exposed. PTH-RIGHT-ANGLE-KIT - Right-angle, through-hole Right Angle Tactile Button <https://www.sparkfun.com/products/10791> - Used on SparkFun BigTime Watch Kit <https://www.sparkfun.com/products/11734> SMD-12MM - 12mm square, surface-mount Tactile Button - SMD (12mm) <https://www.sparkfun.com/products/12993> (COM-12993) Used on SparkFun PicoBoard <https://www.sparkfun.com/products/11888> SMD-4.5MM - 4.5mm Square Trackball Switch Used on SparkFun Blackberry Trackballer Breakout <https://www.sparkfun.com/products/13169> SMD-4.6MMX2.8MM - 4.60mm x 2.80mm, surface mount Used on SparkFun Pro Micro - RP2040 <https://www.sparkfun.com/products/17717> SMD-5.2MM, SMD-5.2-REDUNDANT - 5.2mm square, surface-mount Mini Pushbutton Switch - SMD <https://www.sparkfun.com/products/8720> (COM-08720) Used on Arduino Pro Mini <https://www.sparkfun.com/products/11114> REDUNDANT package connects both switch circuits together SMD-6.0X3.5MM - 6.0 x 3.5mm, surface mount Momentary Reset Switch SMD <https://www.sparkfun.com/products/8229> (COM-08229) SMD-6.2MM-TALL - 6.2mm square, surface mount Tactile Button - SMD (6mm) <https://www.sparkfun.com/products/12992> Used on SparkFun Digital Sandbox <https://www.sparkfun.com/products/12651> SMD-RIGHT-ANGLE - Right-angle, surface mount Used on SparkFun Block for Intel® Edison - Arduino <https://www.sparkfun.com/products/13036>; PROD_ID: SWCH-11966; SF_SKU: COM-12992
SJ1 = jumper:SJ: SMD solder JUMPER
SJ2 = jumper:SJ2W: SMD solder JUMPER
TP1-TP12 TP14-TP25 = testpad:TP: Test pad
U1 = custom:LM2596T: STEP-DOWN VOLTAGE REGULATOR; SPICEPREFIX: X
U2 = custom:MT3608: MT3608 The MT3608 is a constant frequency, 6-pin SOT23 current mode step-up converter intended for small, low power applications. The MT3608 switches at 1.2MHz and allows the use of tiny, low cost capacitors and inductors 2mm or less in height. Internal soft-start results in small inrush current and extends battery life. Datasheet <https://www.olimex.com/Products/Breadboarding/BB-PWR-3608/resources/MT3608.pdf>; SPICEPREFIX: X
U3 = custom:78L*SMD: Positive VOLTAGE REGULATOR
U4 = custom:LM324: OP AMP
U5 U8 = custom:MC34063: Jellybean switching supply controller (IC-11612, also SF)
U6 = custom:MT3608: MT3608 The MT3608 is a constant frequency, 6-pin SOT23 current mode step-up converter intended for small, low power applications. The MT3608 switches at 1.2MHz and allows the use of tiny, low cost capacitors and inductors 2mm or less in height. Internal soft-start results in small inrush current and extends battery life. Datasheet <https://www.olimex.com/Products/Breadboarding/BB-PWR-3608/resources/MT3608.pdf>
U7 = custom:LM2596T: STEP-DOWN VOLTAGE REGULATOR
U9 = custom:TP4056
U10 = custom:4069: Hex INVERTER
U11 = custom:LTV-247
U12 U14 = 74xx-us:74*08: Quad 2-input AND gate
U13 = STM8S003K3T6C:STM8S003K3T6C: Mainstream Value line 8-bit MCU with 8 Kbytes Flash, 16 MHz CPU, integrated EEPROM Check availability <https://pricing.snapeda.com/parts/STM8S003K3T6C/STMicroelectronics/view-part?ref=eda>; AVAILABILITY: In Stock; DESCRIPTION: STM8 series Microcontroller IC 8-Bit 16MHz 8KB (8K x 8) FLASH 32-LQFP (7x7); MF: STMicroelectronics; MP: STM8S003K3T6C; PACKAGE: LQFP-32 STMicroelectronics; PRICE: None; PURCHASE-URL: https://pricing.snapeda.com/search/part/STM8S003K3T6C/?ref=eda
U15 = 40xx:4051: 8-channel ANALOG MULTIPLEXER
U16 U17 = custom:LM358: OP AMP also LM158; LM258; LM2904 Source: http://cache.national.com/ds/LM/LM158.pdf
U18 = 74xx-us:74*32: Quad 2-input OR gate
VR1 VR2 = rcl:R-TRIMM: Trimm resistor; SPICEMODEL: X; SPICEPREFIXL: POT

## Net classes
1 0.1A: width 0.254 mm, drill 0.25 mm
2 1.2A: width 0.406 mm, drill 0.35 mm
3 2A: width 0.813 mm, drill 0.8 mm
4 3A: width 1.422 mm
5 3.5A: width 1.778 mm
6 min 1.2A: width 0.406 mm, drill 0.35 mm